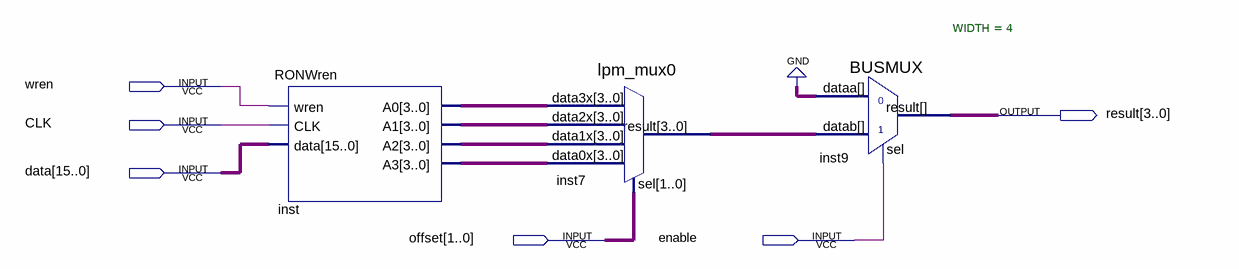
[diagram p0: schematic sheet]
// Quartus schematic Cash.bdf as structural Verilog: 3 symbols, 6 pins
module Cash (
  input  wren,
  input  CLK,
  input  [15:0] data,
  input  [1:0] offset,
  input  enable,
  output [3:0] result
);

  wire [3:0] inst7_result, inst_a0, inst_a1, inst_a2, inst_a3;

  RONWren inst (.wren(wren), .CLK(CLK), .data(data), .A0(inst_a0), .A1(inst_a1), .A2(inst_a2), .A3(inst_a3));
  lpm_mux0 inst7 (
    .data3x(inst_a0), .data2x(inst_a1), .data1x(inst_a2), .data0x(inst_a3), .sel(offset),
    .result(inst7_result));
  BUSMUX #(.WIDTH(4)) inst9 (.datab(inst7_result), .sel(enable), .dataa(4'b0000), .result(result));
endmodule
